# Altium schematic sheet Power.SchDoc
size OrCAD A portrait; SheetNumber: 3; SheetTotal: 5
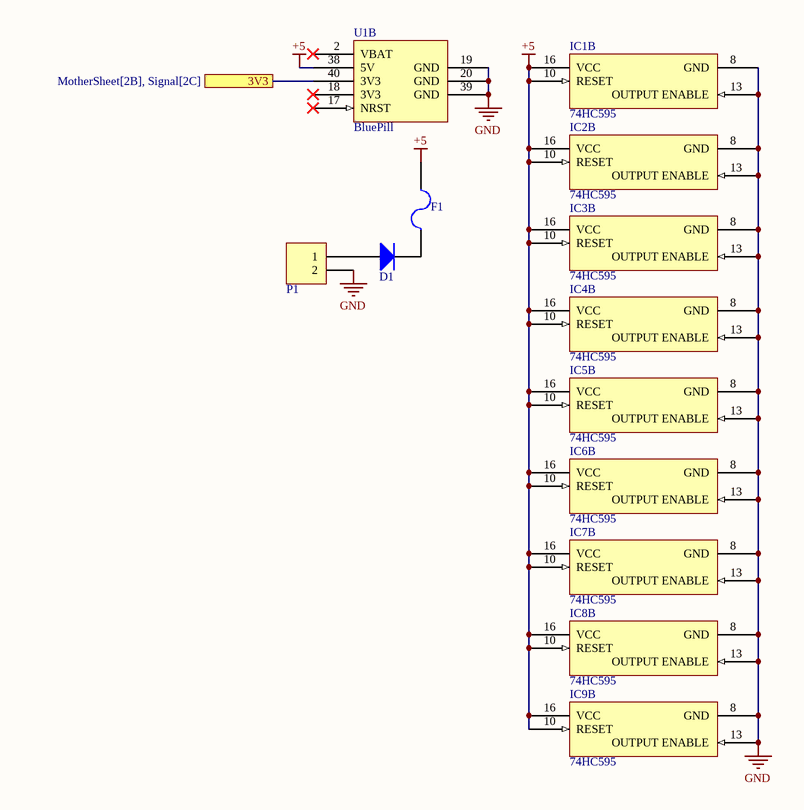
[diagram p0: Power.SchDoc]

## Parts
D1  Diode  [D1A]  (value not drawn)
F1  Fuse  [FUSE SMD]  (value not drawn)
IC1  74HC595  [74HC595]  (part B of 2)
IC2  74HC595  [74HC595]  (part B of 2)
IC3  74HC595  [74HC595]  (part B of 2)
IC4  74HC595  [74HC595]  (part B of 2)
IC5  74HC595  [74HC595]  (part B of 2)
IC6  74HC595  [74HC595]  (part B of 2)
IC7  74HC595  [74HC595]  (part B of 2)
IC8  74HC595  [74HC595]  (part B of 2)
IC9  74HC595  [74HC595]  (part B of 2)
P1  Domino 2  [DOMINO 2- 5mm]  (value not drawn)
U1  BluePill  [BluePill]  (part B of 2)

## Ports
3V3 (see MotherSheet[2B], Signal[2C])

## Nets
+5: F1.2 IC1.10(RESET) IC1.16(VCC) IC2.10(RESET) IC2.16(VCC) IC3.10(RESET) IC3.16(VCC) IC4.10(RESET) IC4.16(VCC) IC5.10(RESET) IC5.16(VCC) IC6.10(RESET) IC6.16(VCC) IC7.10(RESET) IC7.16(VCC) IC8.10(RESET) IC8.16(VCC) IC9.10(RESET) IC9.16(VCC) U1.38(5V)
GND: IC1.8(GND) IC1.13(OUTPUT_ENABLE) IC2.8(GND) IC2.13(OUTPUT_ENABLE) IC3.8(GND) IC3.13(OUTPUT_ENABLE) IC4.8(GND) IC4.13(OUTPUT_ENABLE) IC5.8(GND) IC5.13(OUTPUT_ENABLE) IC6.8(GND) IC6.13(OUTPUT_ENABLE) IC7.8(GND) IC7.13(OUTPUT_ENABLE) IC8.8(GND) IC8.13(OUTPUT_ENABLE) IC9.8(GND) IC9.13(OUTPUT_ENABLE) P1.2 U1.19(GND) U1.20(GND) U1.39(GND)
3V3: U1.40(3V3) ; port 3V3
NetD1_1: D1.1(A) P1.1
NetD1_2: D1.2(K) F1.1

Not connected (* = marked no-connect by the designer): U1 2(VBAT)* 17(NRST)* 18(3V3)*

## Library data of the parts
D1 = Diode: Default Diode
IC1-IC9 = 74HC595: Logic Type: Shift Register; Number of Elements: 1; Number of Bits per Element: 8; Function: Serial to Parallel, Serial; Voltage - Supply: 2V ~ 6V; Output Type: Output Type; Operating Temperature: -55°C ~ 125°C; Package / Case: 16-DIP (0.300", 7.62mm); ComponentLink1Description: Banlinhkien; ComponentLink1URL: https://banlinhkien.com/74hc595-dip16-p6648401.html; ComponentLink2Description: Datasheet; ComponentLink2URL: https://pdf1.alldatasheet.com/datasheet-pdf/view/23121/STMICROELECTRONICS/74HC595.html; ComponentLink3Description: ICDayroi; ComponentLink3URL: https://icdayroi.com/74hc595n
P1 = Domino 2: Domino, 2-Pin; LatestRevisionDate: 17-Jul-2002; LatestRevisionNote: Re-released for DXP Platform.; Publisher: Altium Limited
U1 = BluePill: STM32F103C8T6, mbed-Enabled Development Bluepill STM32F1 ARM® Cortex®-M3 MCU 32-Bit Embedded Evaluation Board; Processor: STM32F103C9T6; Operating/input voltage: 3.3V; CPU speed: 72MHz; Analog pins: 10; Digital IO/PWM: 37; EEPROM/SRAM(KB): -/20; Flash: 64/128K; USB Connector: Micro; UART: 3; SPI: 2; I2C: 2; ComponentLink1Description: Datasheet; ComponentLink1URL: https://components101.com/microcontrollers/stm32f103c8t8-blue-pill-development-board; ComponentLink2Description: Hshop; ComponentLink2URL: https://hshop.vn/products/kit-ra-chon-stm32f103c8t6; ComponentLink3Description: Banlinhkien; ComponentLink3URL: https://banlinhkien.com/kit-stm32f103c8t6-board-mini-p6649312.html